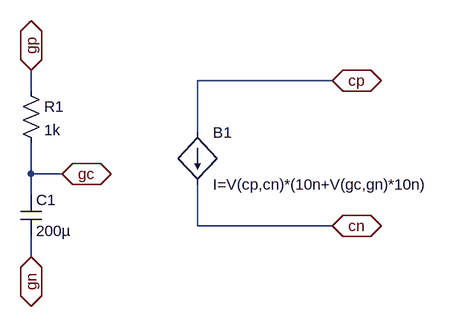
[diagram p0: schematic capteur_graphène.asc]
capteur_graphène.asc, the LTspice schematic file:
Version 4
SHEET 1 880 680
WIRE 416 32 208 32
WIRE -48 48 -48 16
WIRE 208 112 208 32
WIRE -48 176 -48 128
WIRE 0 176 -48 176
WIRE -48 208 -48 176
WIRE 208 256 208 192
WIRE 416 256 208 256
WIRE -48 304 -48 272
FLAG 416 32 cp
IOPIN 416 32 BiDir
FLAG 416 256 cn
IOPIN 416 256 BiDir
FLAG -48 16 gp
IOPIN -48 16 BiDir
FLAG -48 304 gn
IOPIN -48 304 BiDir
FLAG 0 176 gc
IOPIN 0 176 BiDir
SYMBOL bi 208 112 R0
SYMATTR InstName B1
SYMATTR Value I=V(cp,cn)*(10n+V(gc,gn)*10n)
SYMBOL res -64 32 R0
SYMATTR InstName R1
SYMATTR Value 1k
SYMBOL cap -64 208 R0
SYMATTR InstName C1
SYMATTR Value 200µ

The netlist it stands for:
* capteur_graphène.asc
B1 cp cn I=V(cp,cn)*(10n+V(gc,gn)*10n)
R1 gp gc 1k
C1 gc gn 200µ
.backanno
.end